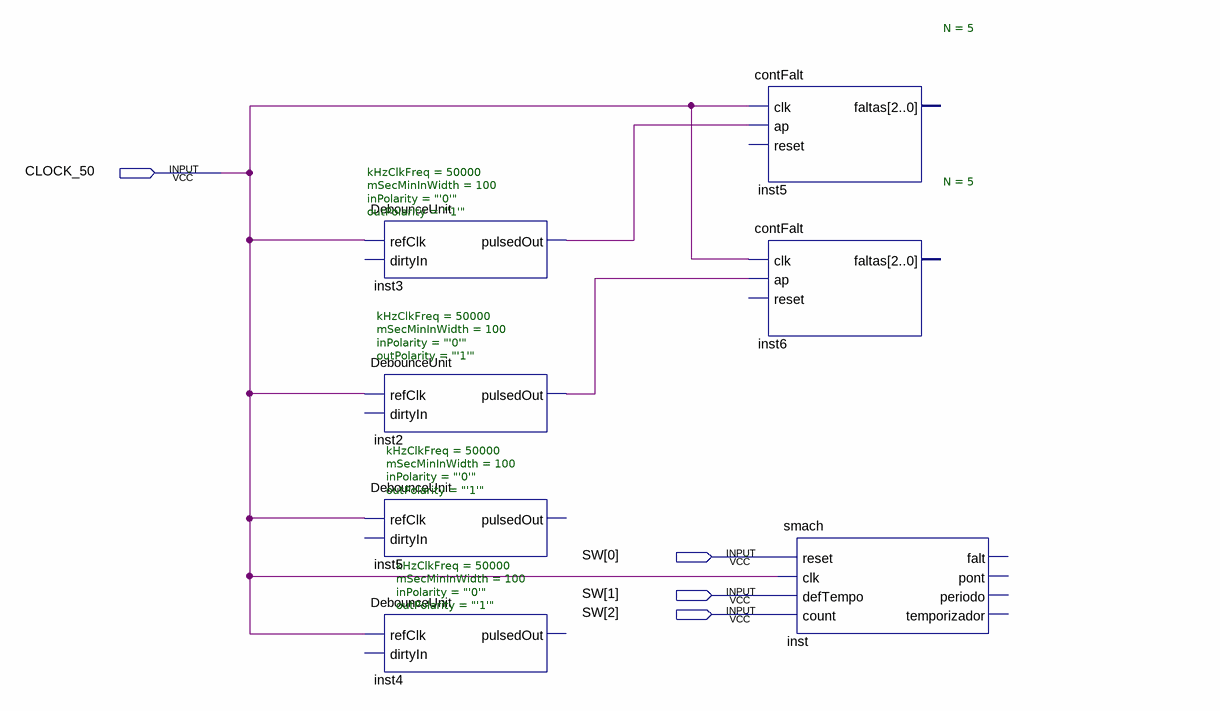
[diagram p0: schematic sheet]
// Quartus schematic fase3.bdf as structural Verilog: 7 symbols, 4 pins
module fase3 (
  input  CLOCK_50,
  input  [2:0] SW
);

  wire inst2_pulsedout, inst3_pulsedout;

  DebounceUnit #(.kHzClkFreq(50000), .mSecMinInWidth(100), .inPolarity("'0'"), .outPolarity("'1'")) inst3 (
    .refClk(CLOCK_50), .pulsedOut(inst3_pulsedout));  // open: dirtyIn
  DebounceUnit #(.kHzClkFreq(50000), .mSecMinInWidth(100), .inPolarity("'0'"), .outPolarity("'1'")) inst2 (
    .refClk(CLOCK_50), .pulsedOut(inst2_pulsedout));  // open: dirtyIn
  DebounceUnit #(.kHzClkFreq(50000), .mSecMinInWidth(100), .inPolarity("'0'"), .outPolarity("'1'")) inst5 (.refClk(CLOCK_50));  // open: dirtyIn, pulsedOut
  DebounceUnit #(.kHzClkFreq(50000), .mSecMinInWidth(100), .inPolarity("'0'"), .outPolarity("'1'")) inst4 (.refClk(CLOCK_50));  // open: dirtyIn, pulsedOut
  contFalt #(.N(5)) inst5_dup2 (.clk(CLOCK_50), .ap(inst3_pulsedout));  // open: reset, faltas
  contFalt #(.N(5)) inst6 (.clk(CLOCK_50), .ap(inst2_pulsedout));  // open: reset, faltas
  smach inst (
    .reset(SW[0]), .clk(CLOCK_50), .defTempo(SW[1]), .count(SW[2]));  // open: falt, pont, periodo, temporizador
endmodule
